# Altium project gimble drv.PrjPcb
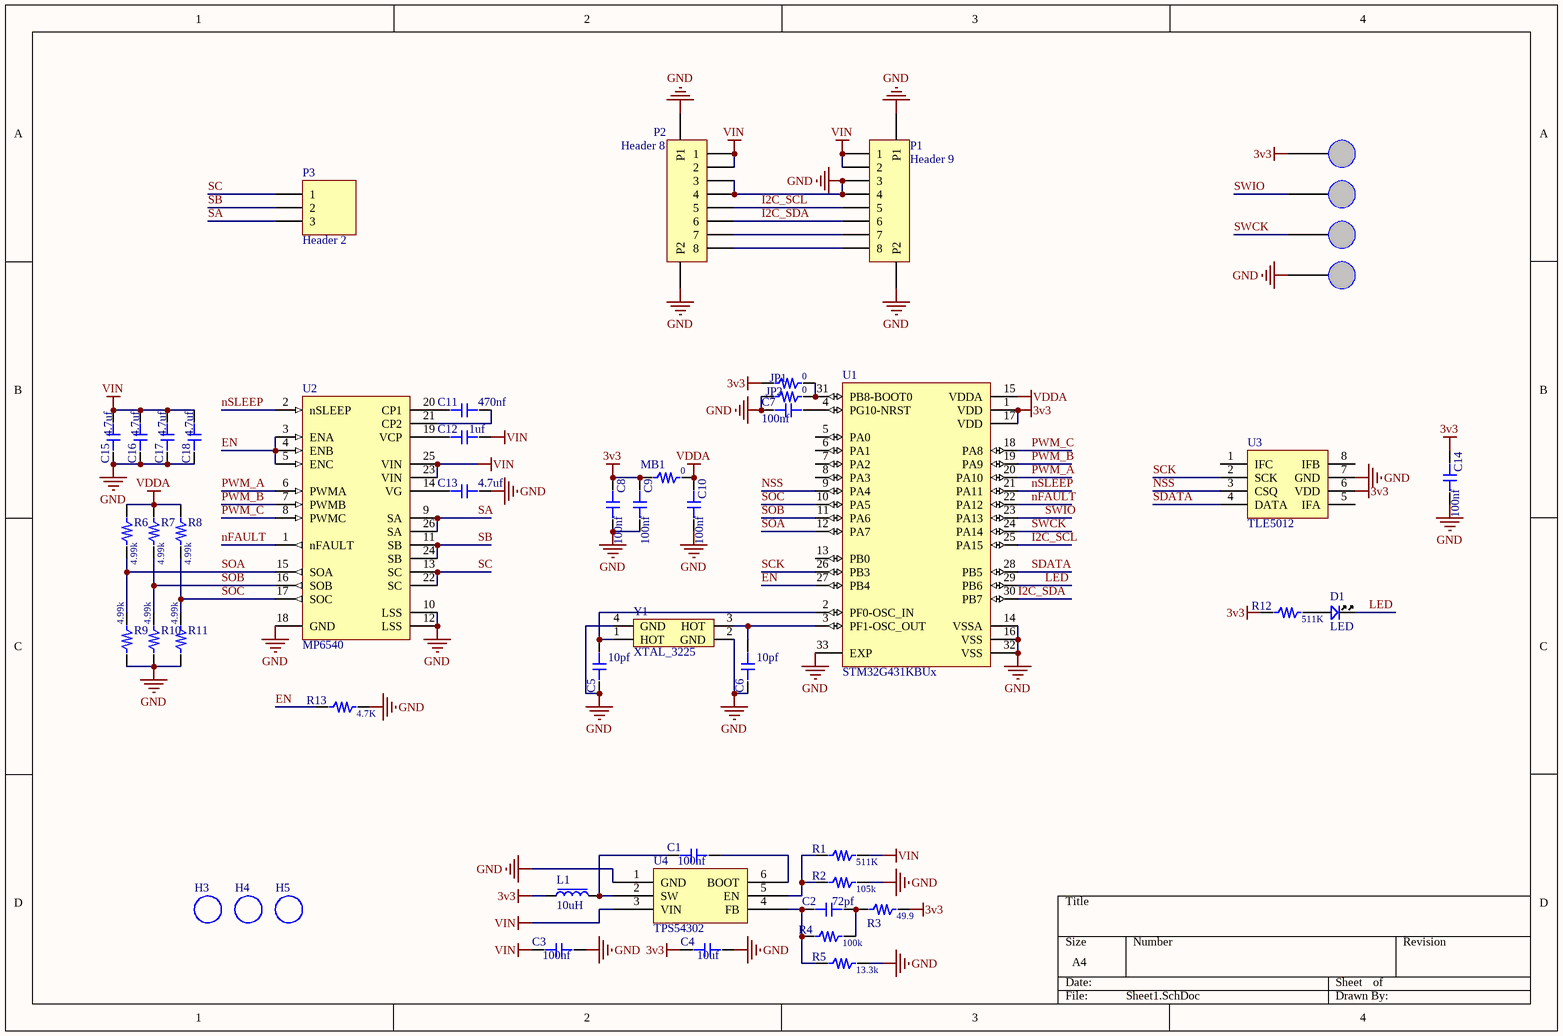
[diagram p0: Sheet1.SchDoc]
1 sheet, 51 parts. Net scope: global (net labels, ports and power ports of the same name join across sheets).
Board file: PCB1.PcbDoc

## Sheet Sheet1.SchDoc
size A4; SheetNumber: 1; SheetTotal: 1

### Parts
3V3  solder_pad  [solder_pad_1]  (value not drawn)
C1  value 100nf  [C_0402]  (hidden comment: C_0603)
C2  value 72pf  [C_0402]  (hidden comment: C_0603)
C3  value 100nf  [C_0402]  (hidden comment: C_0603)
C4  value 10uf  [C_0603]  (hidden comment: C_0603)
C5  value 10pf  [C_0402]  (hidden comment: C_0603)
C6  value 10pf  [C_0402]  (hidden comment: C_0603)
C7  value 100nf  [C_0402]  (hidden comment: C_0603)
C8  value 100nf  [C_0402]  (hidden comment: C_0603)
C9  value 100nf  [C_0402]  (hidden comment: C_0603)
C10  value 100nf  [C_0402]  (hidden comment: C_0603)
C11  value 470nf  [C_0402]  (hidden comment: C_0603)
C12  value 1uf  [C_0402]  (hidden comment: C_0603)
C13  value 4.7uf  [C_0402]  (hidden comment: C_0603)
C14  value 100nf  [C_0402]  (hidden comment: C_0603)
C15  value 4.7uf  [C_0805]  (hidden comment: C_0603)
C16  value 4.7uf  [C_0805]  (hidden comment: C_0603)
C17  value 4.7uf  [C_0805]  (hidden comment: C_0603)
C18  value 4.7uf  [C_0805]  (hidden comment: C_0603)
CK  solder_pad  [solder_pad_1]  (value not drawn)
D1  LED  [LED_0603]
GND  solder_pad  [solder_pad_1]  (value not drawn)
H3  (no value)  [M3 Hole]
H4  (no value)  [M3 Hole]
H5  (no value)  [M3 Hole]
IO  solder_pad  [solder_pad_1]  (value not drawn)
JP1  value 0  [R_0402]  (hidden comment: R_0603)
JP2  value 0  [R_0402]  (hidden comment: R_0603)
L1  10uH  [NR3015]
MB1  value 0  [R_0402]  (hidden comment: R_0603)
P1  Header 9  [JST_SM08B-SRSS-TB(LF)(SN)]
P2  Header 8  [JST_SM08B-SRSS-TB(LF)(SN)]
P3  Header 2  [MOLEX_530480310]
R1  value 511K  [R_0402]  (hidden comment: R_0603)
R2  value 105k  [R_0402]  (hidden comment: R_0603)
R3  value 49.9  [R_0402]  (hidden comment: R_0603)
R4  value 100k  [R_0402]  (hidden comment: R_0603)
R5  value 13.3k  [R_0402]  (hidden comment: R_0603)
R6  value 4.99k  [R_0402]  (hidden comment: R_0603)
R7  value 4.99k  [R_0402]  (hidden comment: R_0603)
R8  value 4.99k  [R_0402]  (hidden comment: R_0603)
R9  value 4.99k  [R_0402]  (hidden comment: R_0603)
R10  value 4.99k  [R_0402]  (hidden comment: R_0603)
R11  value 4.99k  [R_0402]  (hidden comment: R_0603)
R12  value 511K  [R_0402]  (hidden comment: R_0603)
R13  value 4.7K  [R_0402]  (hidden comment: R_0603)
U1  STM32G431KBUx  [QFN32]
U2  MP6540  [QFN26-MPS]
U3  TLE5012  [SOIC8]
U4  TPS54302  [SOT-23-6]
Y1  XTAL_3225  [XTAL-2016]

### Nets
3v3: 3V3.1 C4.1 C8.1 C9.1 C14.1 JP1.1 L1.1 MB1.1 R3.2 R12.1 U1.1(VDD) U1.17(VDD) U3.6(VDD)
GND: C3.2 C4.2 C5.1 C6.1 C7.1 C8.2 C9.2 C10.2 C13.2 C14.2 C15.1 C16.1 C17.1 C18.1 GND.1 JP2.1 P1.3 P1.4 P1.P1 P1.P2 P2.3 P2.4 P2.P1 P2.P2 R2.2 R5.2 R9.1 R10.1 R11.1 R13.2 U1.14(VSSA) U1.16(VSS) U1.32(VSS) U1.33(EXP) U2.10(LSS) U2.12(LSS) U2.18(GND) U3.7(GND) U4.1(GND) Y1.2(GND) Y1.4(GND)
VDDA: C10.1 MB1.2 R6.2 R7.2 R8.2 U1.15(VDDA)
VIN: C3.1 C12.2 C15.2 C16.2 C17.2 C18.2 P1.1 P1.2 P2.1 P2.2 R1.2 U2.23(VIN) U2.25(VIN) U4.3(VIN)
EN: R13.1 U1.27(PB4) U2.3(ENA) U2.4(ENB) U2.5(ENC)
I2C_SCL: P1.5 P2.5 U1.25(PA15)
I2C_SDA: P1.6 P2.6 U1.30(PB7)
LED: D1.C U1.29(PB6)
nFAULT: U1.22(PA12) U2.1(nFAULT)
nSLEEP: U1.21(PA11) U2.2(nSLEEP)
NSS: U1.9(PA4) U3.3(CSQ)
PWM_A: U1.20(PA10) U2.6(PWMA)
PWM_B: U1.19(PA9) U2.7(PWMB)
PWM_C: U1.18(PA8) U2.8(PWMC)
SA: P3.3 U2.9(SA) U2.26(SA)
SB: P3.2 U2.11(SB) U2.24(SB)
SC: P3.1 U2.13(SC) U2.22(SC)
SCK: U1.26(PB3) U3.2(SCK)
SDATA: U1.28(PB5) U3.4(DATA)
SOA: R6.1 R9.2 U1.12(PA7) U2.15(SOA)
SOB: R7.1 R10.2 U1.11(PA6) U2.16(SOB)
SOC: R8.1 R11.2 U1.10(PA5) U2.17(SOC)
SWCK: CK.1 U1.24(PA14)
SWIO: IO.1 U1.23(PA13)
NetC1_1: C1.1 L1.2 U4.2(SW)
NetC1_2: C1.2 U4.6(BOOT)
NetC2_1: C2.1 R4.1 R5.1 U4.4(FB)
NetC2_2: C2.2 R3.1 R4.2
NetC5_2: C5.2 U1.2(PF0-OSC_IN) Y1.1(HOT)
NetC6_2: C6.2 U1.3(PF1-OSC_OUT) Y1.3(HOT)
NetC7_2: C7.2 U1.4(PG10-NRST)
NetC11_1: C11.1 U2.20(CP1)
NetC11_2: C11.2 U2.21(CP2)
NetC12_1: C12.1 U2.19(VCP)
NetC13_1: C13.1 U2.14(VG)
NetD1_A: D1.A R12.2
NetJP1_2: JP1.2 JP2.2 U1.31(PB8-BOOT0)
NetP1_7: P1.7 P2.7
NetP1_8: P1.8 P2.8
NetR1_1: R1.1 R2.1 U4.5(EN)

Not connected (* = marked no-connect by the designer): U1 5(PA0) 6(PA1) 7(PA2) 8(PA3) 13(PB0); U3 1(IFC) 5(IFA) 8(IFB)

### Library data of the parts
C1-C18 = C
D1 = LED_SMD
H3-H5 = M3 Hole: M3 Hole with no copper
JP1 JP2 MB1 R1-R13 = R
L1 = L-NR: NR功率电感
P1 P2 = Header 8: Header, 5-Pin; LatestRevisionDate: 17-Jul-2002; LatestRevisionNote: Re-released for DXP Platform.; Publisher: Altium Limited
P3 = Header 3: Header, 2-Pin; LatestRevisionDate: 17-Jul-2002; LatestRevisionNote: Re-released for DXP Platform.; Publisher: Altium Limited
U1 = STM32G431KBUx: ARMÂ® CortexÂ®-M4F STM32G4 Microcontroller IC 32-Bit 170MHz 128KB (128K x 8) FLASH 32-UFQFPN (5x5); MP: STM32G431KBU3; MF: STMicroelectronics; Price: None; SnapEDA_Link: https://www.snapeda.com/parts/STM32G431KBU3/STMicroelectronics/view-part/4524042/?ref=snap; Value: *; Availability: In Stock; Package: UFQFN-32 STMicroelectronics; Check_prices: https://www.snapeda.com/parts/STM32G431KBU3/STMicroelectronics/view-part/4524042/?ref=eda; Purchase-URL: https://pricing.snapeda.com/search/part/STM32G431KBU3/?ref=eda
U2 = MP6540: MP: STM32G431KBU3; MF: STMicroelectronics; Price: None; SnapEDA_Link: https://www.snapeda.com/parts/STM32G431KBU3/STMicroelectronics/view-part/4524042/?ref=snap; Value: *; Availability: In Stock; Package: UFQFN-32 STMicroelectronics; Check_prices: https://www.snapeda.com/parts/STM32G431KBU3/STMicroelectronics/view-part/4524042/?ref=eda; Purchase-URL: https://pricing.snapeda.com/search/part/STM32G431KBU3/?ref=eda